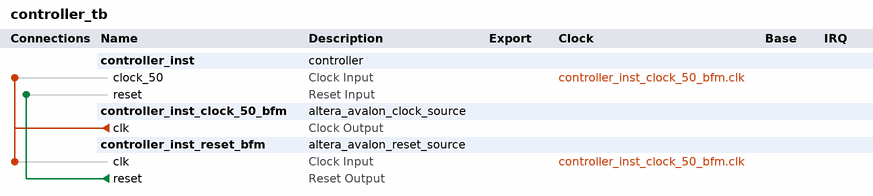
[diagram p0: system contents]
# Platform Designer (Qsys) system controller_tb, Cyclone III EP3C16Q240C8
# Parameters at their usual value, and those the tool derives, are not listed.
package require -exact qsys 13.1
create_system controller_tb
set_project_property DEVICE_FAMILY {Cyclone III}
set_project_property DEVICE EP3C16Q240C8

add_instance controller_inst controller 1.0

add_instance controller_inst_clock_50_bfm altera_avalon_clock_source 13.1

add_instance controller_inst_reset_bfm altera_avalon_reset_source 13.1
set_instance_parameter_value controller_inst_reset_bfm ASSERT_HIGH_RESET 0
set_instance_parameter_value controller_inst_reset_bfm INITIAL_RESET_CYCLES 50

# connections
add_connection controller_inst_clock_50_bfm.clk controller_inst.clock_50 clock
add_connection controller_inst_clock_50_bfm.clk controller_inst_reset_bfm.clk clock
add_connection controller_inst_reset_bfm.reset controller_inst.reset reset

set_interconnect_requirement {$system} qsys_mm.clockCrossingAdapter HANDSHAKE
set_interconnect_requirement {$system} qsys_mm.maxAdditionalLatency 1
set_interconnect_requirement {$system} qsys_mm.insertDefaultSlave false

save_system controller_tb.qsys
